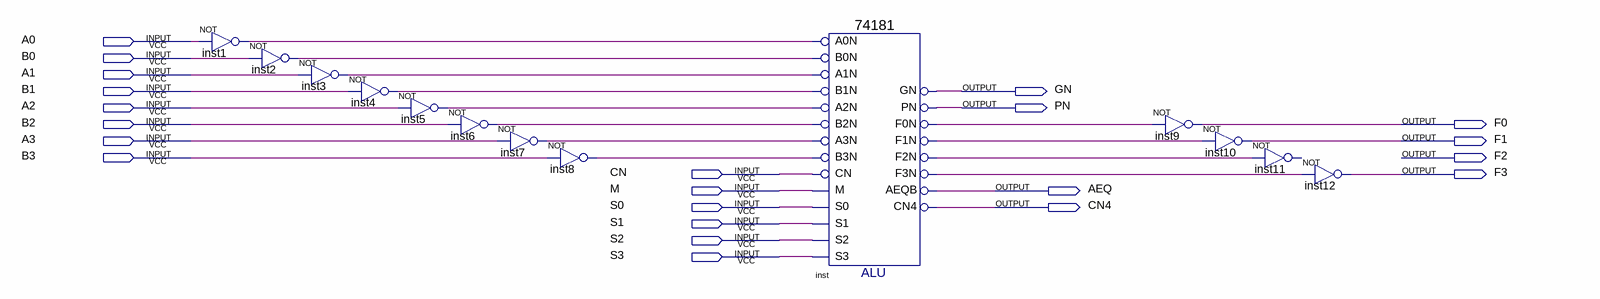
[diagram p0: schematic sheet]
// Quartus schematic N_ALU.bdf as structural Verilog: 13 symbols, 22 pins
module N_ALU (
  input  A0,
  input  B0,
  input  A1,
  input  B1,
  input  A2,
  input  B2,
  input  A3,
  input  B3,
  input  CN,
  input  M,
  input  S0,
  input  S1,
  input  S2,
  input  S3,
  output GN,
  output PN,
  output F0,
  output F1,
  output F2,
  output F3,
  output AEQ,
  output CN4
);

  wire inst1_out, inst2_out, inst3_out, inst4_out, inst5_out, inst6_out, inst7_out, inst8_out, inst_f0n,
       inst_f1n, inst_f2n, inst_f3n;

  not inst1 (inst1_out, A0);
  not inst2 (inst2_out, B0);
  not inst3 (inst3_out, A1);
  not inst4 (inst4_out, B1);
  not inst5 (inst5_out, A2);
  not inst6 (inst6_out, B2);
  not inst7 (inst7_out, A3);
  not inst8 (inst8_out, B3);
  \74181  inst (
    .B0N(inst2_out), .A0N(inst1_out), .A1N(inst3_out), .B1N(inst4_out), .A3N(inst7_out), .B2N(inst6_out),
    .A2N(inst5_out), .M(M), .CN(CN), .B3N(inst8_out), .S2(S2), .S1(S1), .S0(S0), .S3(S3), .PN(PN), .GN(GN),
    .F3N(inst_f3n), .F1N(inst_f1n), .F0N(inst_f0n), .AEQB(AEQ), .CN4(CN4), .F2N(inst_f2n));
  not inst9 (F0, inst_f0n);
  not inst10 (F1, inst_f1n);
  // NOT inst11 has open pins: IN=inst_f2n, OUT=open
  not inst12 (F3, inst_f3n);
endmodule
